# Altium schematic sheet valve_schematic.SchDoc
size A
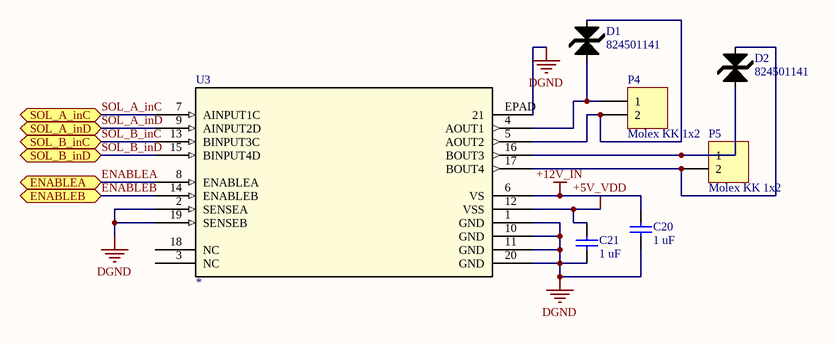
[diagram p0: valve_schematic.SchDoc]

## Parts
C20  1 uF  [C0603]
C21  1 uF  [C0603]
D1  824501141  [DIODE-SMA]
D2  824501141  [DIODE-SMA]
P4  Molex KK 1x2  [Molex KK 2x1]
P5  Molex KK 1x2  [Molex KK 2x1]
U3  *  [PowerSO-20]

## Ports
ENABLEA, ENABLEB, SOL_A_inC, SOL_A_inD, SOL_B_inC, SOL_B_inD

## Nets
+5V_VDD: C21.1 U3.12(VSS)
+12V_IN: C20.1 U3.6(VS)
DGND: C20.2 C21.2 U3.1(GND) U3.2(SENSEA) U3.10(GND) U3.11(GND) U3.19(SENSEB) U3.20(GND) U3.EPAD(21)
ENABLEA: U3.8(ENABLEA) ; port ENABLEA
ENABLEB: U3.14(ENABLEB) ; port ENABLEB
SOL_A_inC: U3.7(AINPUT1C) ; port SOL_A_inC
SOL_A_inD: U3.9(AINPUT2D) ; port SOL_A_inD
SOL_B_inC: U3.13(BINPUT3C) ; port SOL_B_inC
SOL_B_inD: U3.15(BINPUT4D) ; port SOL_B_inD
NetD1_A: D1.A P4.1 U3.4(AOUT1)
NetD1_K: D1.K P4.2 U3.5(AOUT2)
NetD2_A: D2.A P5.1 U3.16(BOUT3)
NetD2_K: D2.K P5.2 U3.17(BOUT4)

Not connected (* = marked no-connect by the designer): U3 3(NC) 18(NC)

## Library data of the parts
C20 C21 = C0603: 0603 Capacitor; Value: 1 uF
D1 D2 = 824501141: TVS DIODE 14V 23.2V DO214AC; Supplier 1: Digi-Key; Supplier Part Number 1: SMCJ120CABTR-ND
P4 P5 = Molex KK 1x2: 1x2 Molex KK Connector
U3 = L298P013TR: Imported; Vendor: ST Microelectronics; Built_By: EMA_UL_Team; C: Copyright (C) 2015 Accelerated Designs. All rights reserved; Manufacturer_Part_Number: L298P013TR; Value: Value; Type: Type; RefDes: RefDes